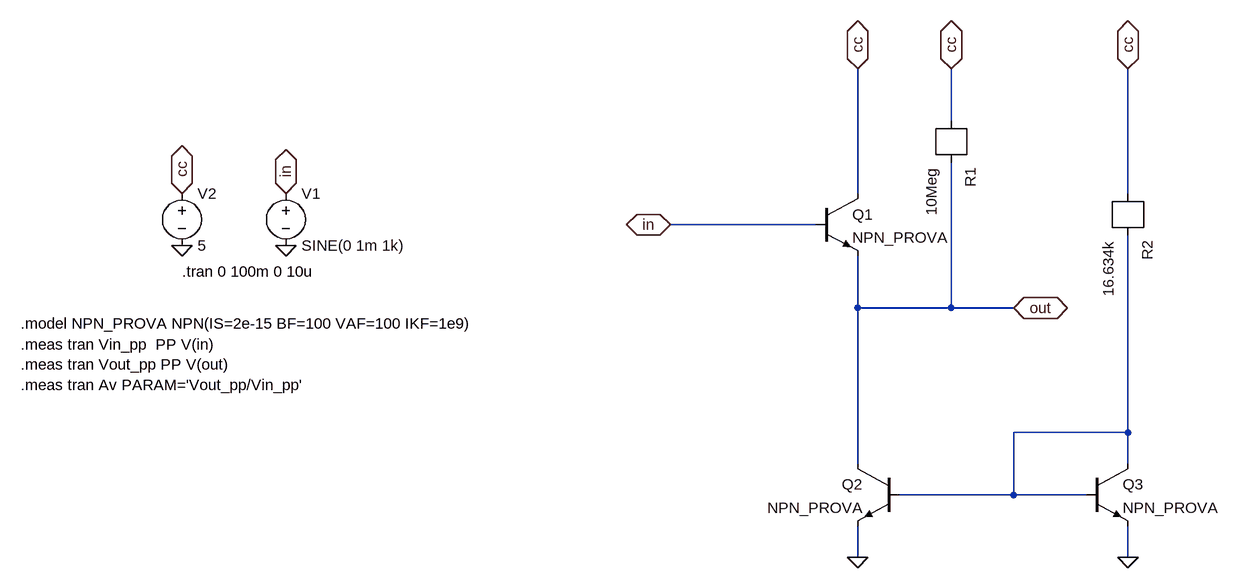
[diagram p0: schematic circuit_lt.asc]
circuit_lt.asc, the LTspice schematic file:
Version 4
SHEET 1 1268 696
WIRE 848 0 848 -80
WIRE 704 112 704 -80
WIRE 1120 112 1120 -80
WIRE 640 160 416 160
WIRE 704 288 704 208
WIRE 848 288 848 64
WIRE 848 288 704 288
WIRE 944 288 848 288
WIRE 1120 480 1120 176
WIRE 1120 480 944 480
WIRE 704 528 704 288
WIRE 1120 528 1120 480
WIRE 944 576 944 480
WIRE 944 576 768 576
WIRE 1056 576 944 576
WIRE 704 672 704 624
WIRE 1120 672 1120 624
FLAG -336 192 0
FLAG -176 192 0
FLAG -336 112 cc
IOPIN -336 112 BiDir
FLAG -176 112 in
IOPIN -176 112 BiDir
FLAG 704 -80 cc
IOPIN 704 -80 BiDir
FLAG 944 288 out
IOPIN 944 288 BiDir
FLAG 1120 -80 cc
IOPIN 1120 -80 BiDir
FLAG 704 672 0
FLAG 1120 672 0
FLAG 416 160 in
IOPIN 416 160 BiDir
FLAG 848 -80 cc
IOPIN 848 -80 BiDir
SYMBOL voltage -176 96 R0
SYMATTR InstName V1
SYMATTR Value SINE(0 1m 1k)
SYMBOL voltage -336 96 R0
SYMATTR InstName V2
SYMATTR Value 5
SYMBOL npn 640 112 R0
SYMATTR InstName Q1
SYMATTR Value NPN_PROVA
SYMBOL npn 768 528 M0
SYMATTR InstName Q2
SYMATTR Value NPN_PROVA
SYMBOL npn 1056 528 R0
SYMATTR InstName Q3
SYMATTR Value NPN_PROVA
SYMBOL r 1120 112 R90
SYMATTR InstName R2
SYMATTR Value 16.634k
SYMBOL r 848 0 R90
SYMATTR InstName R1
SYMATTR Value 10Meg
TEXT -584 312 Left 2 !.model NPN_PROVA NPN(IS=2e-15 BF=100 VAF=100 IKF=1e9)
TEXT -336 232 Left 2 !.tran 0 100m 0 10u
TEXT -584 344 Left 2 !.meas tran Vin_pp  PP V(in)\n.meas tran Vout_pp PP V(out)\n.meas tran Av PARAM='Vout_pp/Vin_pp'

The netlist it stands for:
* circuit_lt.asc
V1 in 0 SINE(0 1m 1k)
V2 cc 0 5
Q1 cc in out 0 NPN_PROVA
Q2 out N001 0 0 NPN_PROVA
Q3 N001 N001 0 0 NPN_PROVA
R2 N001 cc 16.634k
R1 out cc 10Meg
.model NPN NPN
.model PNP PNP
.lib standard.bjt
.model NPN_PROVA NPN(IS=2e-15 BF=100 VAF=100 IKF=1e9)
.tran 0 100m 0 10u
.meas tran Vin_pp  PP V(in)
.meas tran Vout_pp PP V(out)
.meas tran Av PARAM='Vout_pp/Vin_pp'
.backanno
.end